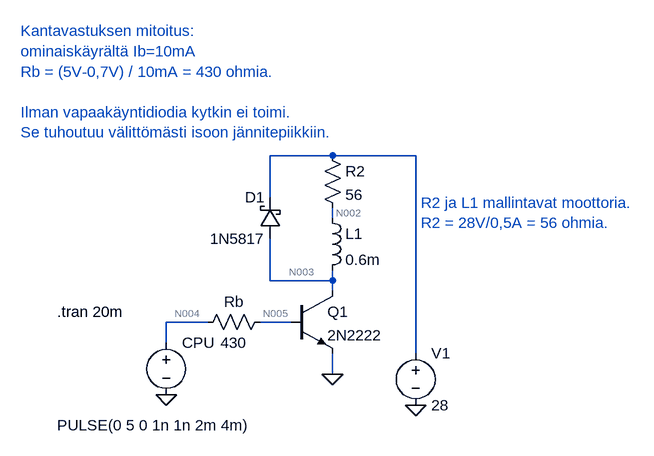
[diagram p0: schematic HT_teht6_kytkinkäyttö.asc]
HT_teht6_kytkinkäyttö.asc, the LTspice schematic file:
Version 4
SHEET 1 880 680
WIRE 304 64 208 64
WIRE 432 64 304 64
WIRE 208 128 208 64
WIRE 304 160 304 144
WIRE 208 256 208 192
WIRE 304 256 304 240
WIRE 304 256 208 256
WIRE 304 272 304 256
WIRE 112 320 48 320
WIRE 240 320 192 320
WIRE 48 352 48 320
WIRE 432 368 432 64
WIRE 304 400 304 368
FLAG 48 432 0
FLAG 432 448 0
FLAG 304 400 0
SYMBOL npn 240 272 R0
SYMATTR InstName Q1
SYMATTR Value 2N2222
SYMBOL res 96 336 R270
WINDOW 0 32 56 VTop 2
WINDOW 3 0 56 VBottom 2
SYMATTR InstName Rb
SYMATTR Value 430
SYMBOL res 288 48 R0
SYMATTR InstName R2
SYMATTR Value 56
SYMBOL ind 288 144 R0
SYMATTR InstName L1
SYMATTR Value 0.6m
SYMBOL voltage 432 352 R0
WINDOW 123 0 0 Left 2
WINDOW 39 0 0 Left 2
SYMATTR InstName V1
SYMATTR Value 28
SYMBOL voltage 48 336 R0
WINDOW 3 -168 143 Left 2
WINDOW 123 0 0 Left 2
WINDOW 39 0 0 Left 2
SYMATTR Value PULSE(0 5 0 1n 1n 2m 4m)
SYMATTR InstName CPU
SYMBOL schottky 224 192 R180
WINDOW 0 24 64 Left 2
WINDOW 3 24 0 Left 2
SYMATTR InstName D1
SYMATTR Value 1N5817
SYMATTR Description Diode
SYMATTR Type diode
TEXT -120 304 Left 2 !.tran 20m
TEXT -176 -128 Left 2 ;Kantavastuksen mitoitus:\nominaiskäyrältä Ib=10mA\nRb = (5V-0,7V) / 10mA = 430 ohmia.\n \nIlman vapaakäyntidiodia kytkin ei toimi.\nSe tuhoutuu välittömästi isoon jännitepiikkiin.
TEXT 440 136 Left 2 ;R2 ja L1 mallintavat moottoria.\nR2 = 28V/0,5A = 56 ohmia.

The netlist it stands for:
* HT_teht6_kytkinkäyttö.asc
Q1 N003 N005 0 0 2N2222
Rb N004 N005 430
R2 N001 N002 56
L1 N002 N003 0.6m
V1 N001 0 28
V§CPU N004 0 PULSE(0 5 0 1n 1n 2m 4m)
D1 N003 N001 1N5817
.model D D
.lib standard.dio
.model NPN NPN
.model PNP PNP
.lib standard.bjt
.tran 20m
* Kantavastuksen mitoitus:
* ominaiskäyrältä Ib=10mA
* Rb = (5V-0,7V) / 10mA = 430 ohmia.
* Ilman vapaakäyntidiodia kytkin ei toimi.
* Se tuhoutuu välittömästi isoon jännitepiikkiin.
* R2 ja L1 mallintavat moottoria.
* R2 = 28V/0,5A = 56 ohmia.
.backanno
.end

* Results of the author's LTspice run, read from the files saved beside the schematic
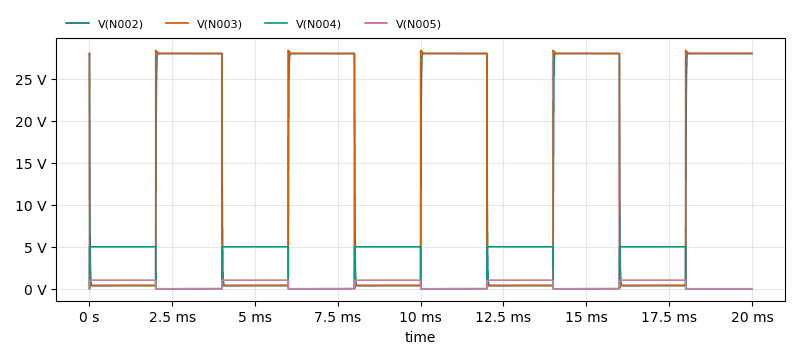
[diagram p1: Transient Analysis of HT_teht6_kytkinkäyttö.asc, plotted from the saved traces]
* Transient Analysis, 1 run:
*   V(N002): min 383 mV, max 28 V, average 14.19 V, rms 19.75 V, last 28 V
*   V(N003): min 31.01 mV, max 28.37 V, average 14.19 V, rms 19.8 V, last 28 V
*   V(N004): min 0 V, max 5 V, average 2.5 V, rms 3.536 V, last 0 V
*   V(N005): min -175.7 µV, max 1.034 V, average 516.7 mV, rms 730.7 mV, last 0 V